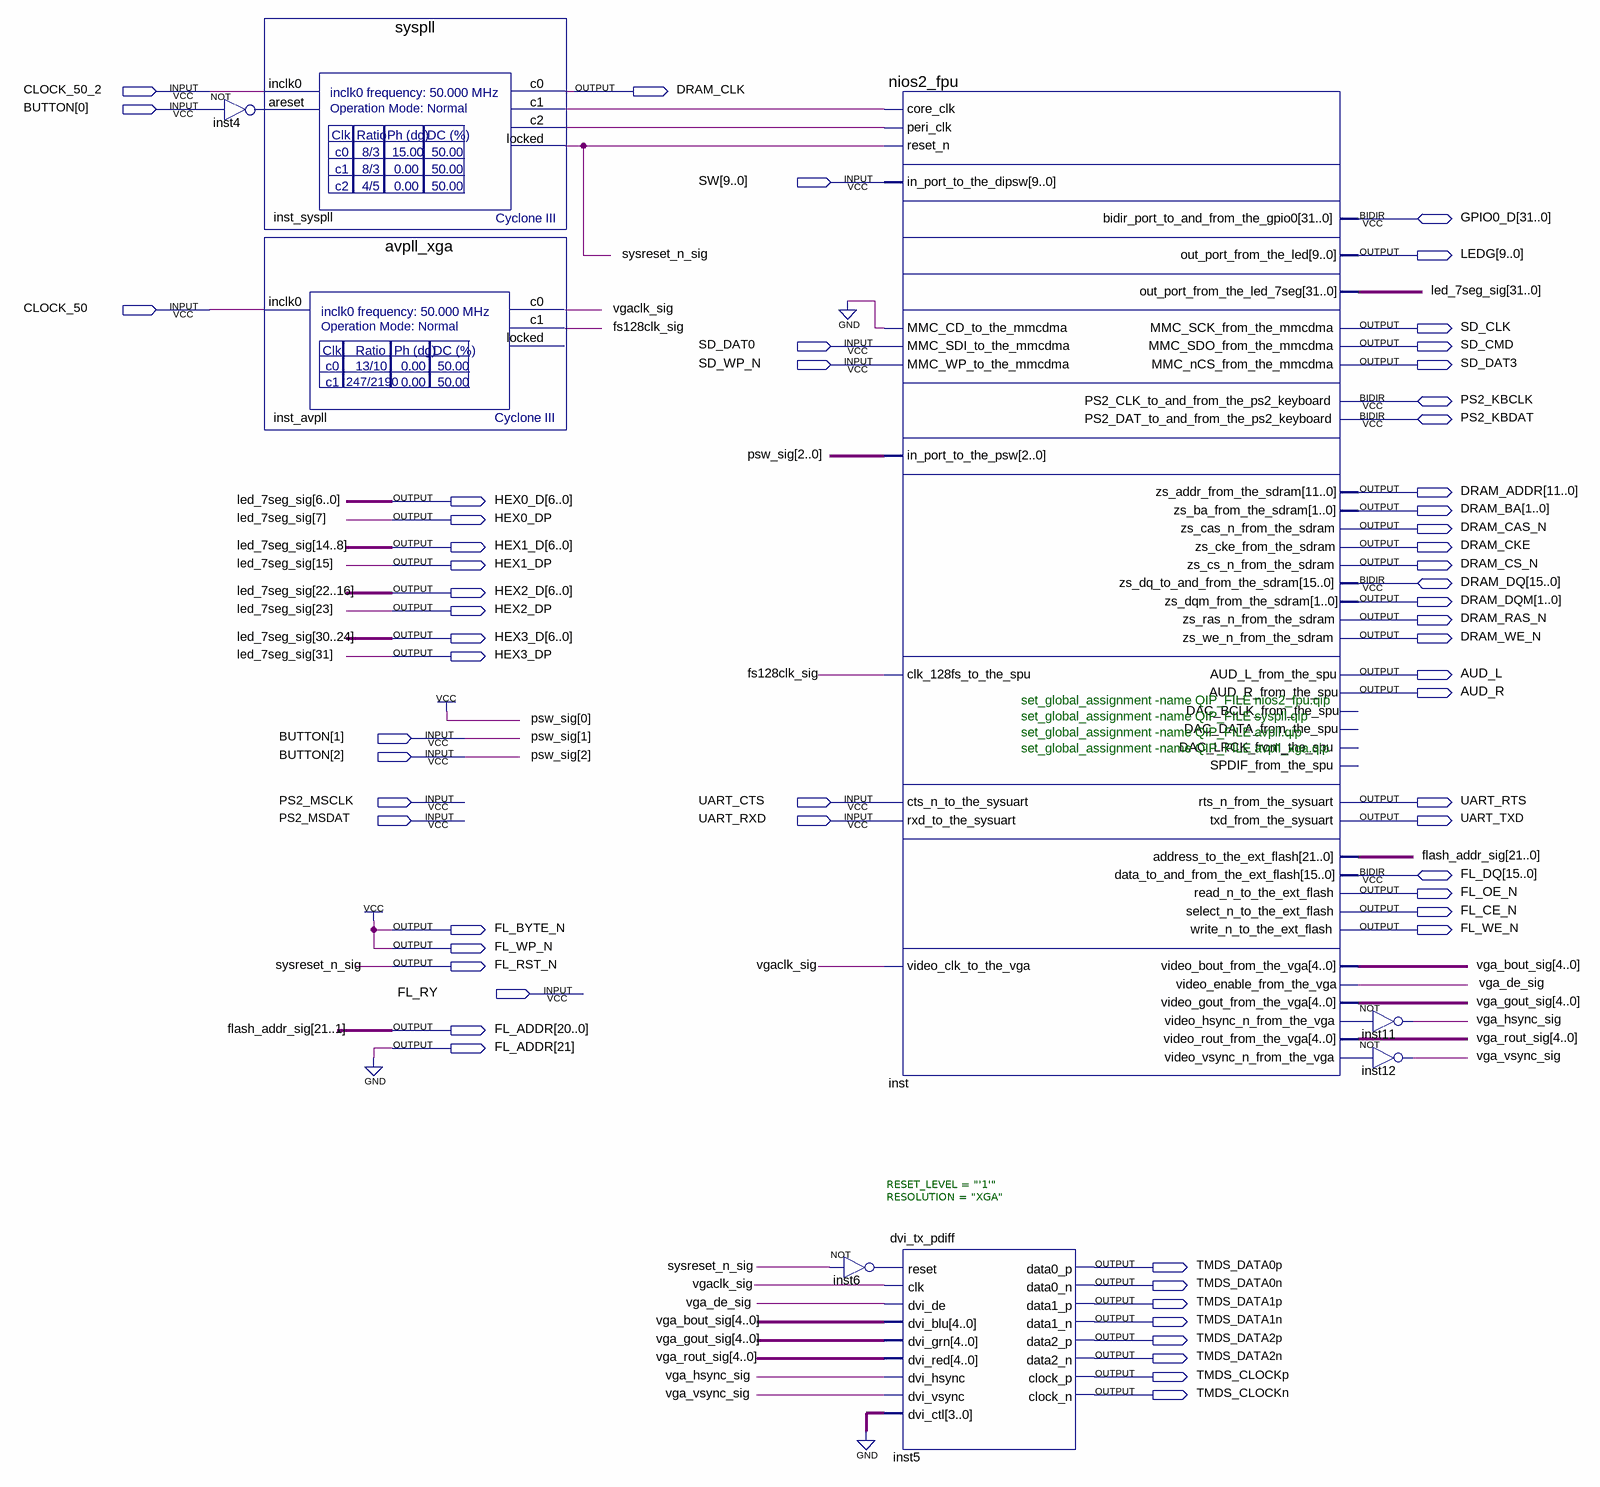
[diagram p0: schematic sheet]
// Quartus schematic cineraria.bdf as structural Verilog: 8 symbols, 59 pins
module cineraria (
  input  CLOCK_50_2,
  input  [2:0] BUTTON,
  input  [9:0] SW,
  input  CLOCK_50,
  input  SD_DAT0,
  input  SD_WP_N,
  input  PS2_MSCLK,
  input  UART_CTS,
  input  PS2_MSDAT,
  input  UART_RXD,
  input  FL_RY,
  inout  [31:0] GPIO0_D,
  inout  PS2_KBCLK,
  inout  PS2_KBDAT,
  inout  [15:0] DRAM_DQ,
  inout  [15:0] FL_DQ,
  output DRAM_CLK,
  output [9:0] LEDG,
  output SD_CLK,
  output SD_CMD,
  output SD_DAT3,
  output [11:0] DRAM_ADDR,
  output [6:0] HEX0_D,
  output [1:0] DRAM_BA,
  output HEX0_DP,
  output DRAM_CAS_N,
  output [6:0] HEX1_D,
  output DRAM_CKE,
  output HEX1_DP,
  output DRAM_CS_N,
  output [6:0] HEX2_D,
  output [1:0] DRAM_DQM,
  output HEX2_DP,
  output DRAM_RAS_N,
  output [6:0] HEX3_D,
  output DRAM_WE_N,
  output HEX3_DP,
  output AUD_L,
  output AUD_R,
  output UART_RTS,
  output UART_TXD,
  output FL_OE_N,
  output FL_CE_N,
  output FL_BYTE_N,
  output FL_WE_N,
  output FL_WP_N,
  output FL_RST_N,
  output [21:0] FL_ADDR,
  output TMDS_DATA0p,
  output TMDS_DATA0n,
  output TMDS_DATA1p,
  output TMDS_DATA1n,
  output TMDS_DATA2p,
  output TMDS_DATA2n,
  output TMDS_CLOCKp,
  output TMDS_CLOCKn
);

  wire fs128clk_sig, inst4_out, inst6_out, inst_syspll_c1, inst_syspll_c2, inst_video_hsync_n_from_the_vga,
       inst_video_vsync_n_from_the_vga, vga_de_sig, vga_hsync_sig, vga_vsync_sig, vgaclk_sig;
  wire [0:0] flash_addr_sig;
  wire [4:0] vga_bout_sig, vga_gout_sig, vga_rout_sig;

  not inst4 (inst4_out, BUTTON[0]);
  syspll inst_syspll (
    .inclk0(CLOCK_50_2), .areset(inst4_out), .c0(DRAM_CLK), .c1(inst_syspll_c1), .c2(inst_syspll_c2),
    .locked(FL_RST_N));
  avpll_xga inst_avpll (.inclk0(CLOCK_50), .c0(vgaclk_sig), .c1(fs128clk_sig));  // open: locked
  not inst6 (inst6_out, FL_RST_N);
  nios2_fpu inst (
    .core_clk(inst_syspll_c1), .peri_clk(inst_syspll_c2), .reset_n(FL_RST_N), .in_port_to_the_dipsw(SW),
    .MMC_CD_to_the_mmcdma(1'b0), .MMC_SDI_to_the_mmcdma(SD_DAT0), .MMC_WP_to_the_mmcdma(SD_WP_N),
    .in_port_to_the_psw({BUTTON[2:1], 1'b1}), .clk_128fs_to_the_spu(fs128clk_sig),
    .cts_n_to_the_sysuart(UART_CTS), .rxd_to_the_sysuart(UART_RXD), .video_clk_to_the_vga(vgaclk_sig),
    .out_port_from_the_led(LEDG),
    .out_port_from_the_led_7seg({HEX3_DP, HEX3_D, HEX2_DP, HEX2_D, HEX1_DP, HEX1_D, HEX0_DP, HEX0_D}),
    .MMC_SCK_from_the_mmcdma(SD_CLK), .MMC_SDO_from_the_mmcdma(SD_CMD), .MMC_nCS_from_the_mmcdma(SD_DAT3),
    .zs_addr_from_the_sdram(DRAM_ADDR), .zs_ba_from_the_sdram(DRAM_BA), .zs_cas_n_from_the_sdram(DRAM_CAS_N),
    .zs_cke_from_the_sdram(DRAM_CKE), .zs_cs_n_from_the_sdram(DRAM_CS_N), .zs_dqm_from_the_sdram(DRAM_DQM),
    .zs_ras_n_from_the_sdram(DRAM_RAS_N), .zs_we_n_from_the_sdram(DRAM_WE_N), .AUD_L_from_the_spu(AUD_L),
    .AUD_R_from_the_spu(AUD_R), .rts_n_from_the_sysuart(UART_RTS), .txd_from_the_sysuart(UART_TXD),
    .address_to_the_ext_flash({FL_ADDR[20:0], flash_addr_sig[0]}), .read_n_to_the_ext_flash(FL_OE_N),
    .select_n_to_the_ext_flash(FL_CE_N), .write_n_to_the_ext_flash(FL_WE_N),
    .video_bout_from_the_vga(vga_bout_sig), .video_enable_from_the_vga(vga_de_sig),
    .video_gout_from_the_vga(vga_gout_sig), .video_hsync_n_from_the_vga(inst_video_hsync_n_from_the_vga),
    .video_rout_from_the_vga(vga_rout_sig), .video_vsync_n_from_the_vga(inst_video_vsync_n_from_the_vga),
    .bidir_port_to_and_from_the_gpio0(GPIO0_D), .PS2_CLK_to_and_from_the_ps2_keyboard(PS2_KBCLK),
    .PS2_DAT_to_and_from_the_ps2_keyboard(PS2_KBDAT), .zs_dq_to_and_from_the_sdram(DRAM_DQ),
    .data_to_and_from_the_ext_flash(FL_DQ));  // open: DAC_BCLK_from_the_spu, DAC_DATA_from_the_spu, DAC_LRCK_from_the_spu, SPDIF_from_the_spu
  dvi_tx_pdiff #(.RESET_LEVEL("'1'"), .RESOLUTION("XGA")) inst5 (
    .reset(inst6_out), .clk(vgaclk_sig), .dvi_de(vga_de_sig), .dvi_blu(vga_bout_sig), .dvi_grn(vga_gout_sig),
    .dvi_red(vga_rout_sig), .dvi_hsync(vga_hsync_sig), .dvi_vsync(vga_vsync_sig), .dvi_ctl(4'b0000),
    .data0_p(TMDS_DATA0p), .data0_n(TMDS_DATA0n), .data1_p(TMDS_DATA1p), .data1_n(TMDS_DATA1n),
    .data2_p(TMDS_DATA2p), .data2_n(TMDS_DATA2n), .clock_p(TMDS_CLOCKp), .clock_n(TMDS_CLOCKn));
  not inst11 (vga_hsync_sig, inst_video_hsync_n_from_the_vga);
  not inst12 (vga_vsync_sig, inst_video_vsync_n_from_the_vga);

  assign FL_ADDR[21] = 1'b0;
  assign FL_BYTE_N = 1'b1;
  assign FL_WP_N = 1'b1;

  // Other names for the same wires on the sheet: flash_addr_sig[21:1] = FL_ADDR[20:0];
  //   led_7seg_sig[31:0] = {HEX3_DP, HEX3_D, HEX2_DP, HEX2_D, HEX1_DP, HEX1_D, HEX0_DP, HEX0_D};
  //   psw_sig[2:1] = BUTTON[2:1]; sysreset_n_sig = FL_RST_N

  // Notes on the sheet:
  //   set_global_assignment -name QIP_FILE nios2_fpu.qip
  //   set_global_assignment -name QIP_FILE syspll.qip
  //   set_global_assignment -name QIP_FILE avpll.qip
  //   set_global_assignment -name QIP_FILE avpll_xga.qip
endmodule
